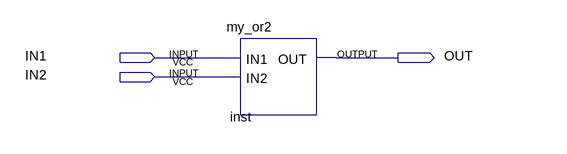
[diagram p0: schematic sheet]
// Quartus schematic test3a.bdf as structural Verilog: 1 symbols, 3 pins
module test3a (
  input  IN1,
  input  IN2,
  output OUT
);

  my_or2 inst (.IN1(IN1), .IN2(IN2), .OUT(OUT));
endmodule
